# Altium schematic sheet IC2.SchDoc
size A4; SheetNumber: 2; SheetTotal: 4
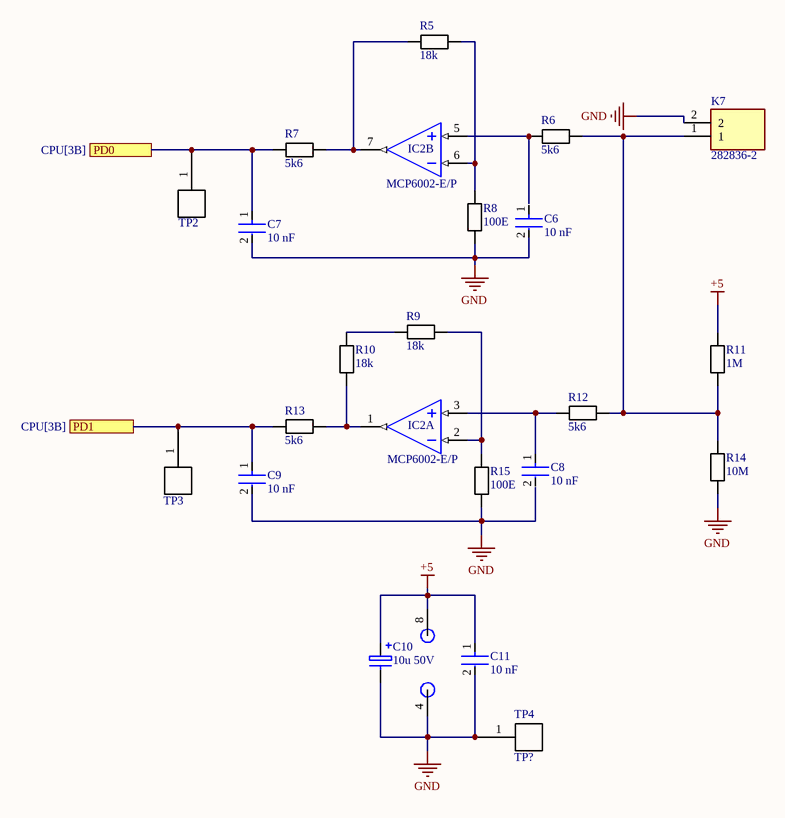
[diagram p0: IC2.SchDoc]

## Parts
C6  10 nF  [0805]
C7  10 nF  [0805]
C8  10 nF  [0805]
C9  10 nF  [0805]
C10  10u 50V  [Elco 10uF 50V]
C11  10 nF  [0805]
IC2  MCP6002-E/P  [MCP6002-E/P]  (parts A,B of 2)
K7  282836-2  [Schroefconnector 2 Pin]
R5  18k  [registor]
R6  5k6  [registor]
R7  5k6  [registor]
R8  100E  [registor]
R9  18k  [registor]
R10  18k  [registor]
R11  1M  [registor]
R12  5k6  [registor]
R13  5k6  [registor]
R14  10M  [registor]
R15  100E  [registor]
TP2  TP2  [testpunt]  (value not drawn)
TP3  TP?  [testpunt]  (value not drawn)
TP4  TP?  [testpunt]

## Ports
PD0 (see CPU[3B]), PD1 (see CPU[3B])

## Nets
+5: C10.1 C11.1 IC2.8 R11.1
GND: C6.2 C7.2 C9.2 C10.2 C11.2 IC2.4 K7.2 R8.1 R14.1 R15.1 TP4.1
PD0: C7.1 R7.1 TP2.1 ; port PD0
PD1: C9.1 R13.1 TP3.1 ; port PD1
NetC8_1: C8.1 IC2.3(VINA+) R12.1
NetIC2_1: IC2.1(VOUTA) R10.2 R13.2
NetIC2_2: IC2.2(VINA-) R9.1 R15.2
NetIC2_5: IC2.5(VINB+) R6.1
NetIC2_6: IC2.6(VINB-) R5.2 R8.2
NetIC2_7: IC2.7(VOUTB) R5.1 R7.2
NetK7_1: K7.1 R6.2 R11.2 R12.2 R14.2
NetR9_2: R9.2 R10.1

Not connected (* = marked no-connect by the designer): C6 1; C8 2

## Library data of the parts
C6-C9 C11 = Condensator 0805: Chip Multilayer Ceramic Capacitors for General Purpose, 0805, 10uF, X5R, 15%, 10%, 25V; Length: 2mm; Depth: 1.25mm; Termination: SMD/SMT; Voltage: 25V; Height: 1.25mm; Material: Ceramic; Thickness: 0.053inch; Radiation Hardening: No; Min Operating Temperature: -55°C; Width: 0.049inch; Package Quantity: 1; Mount: Surface Mount; Dielectric: X5R; Packaging: Tape and Reel; Capacitance: 10uF; Voltage Rating (DC): 25V; Lead Free: Lead Free; Max Operating Temperature: 85°C; Case Code (Imperial): 0805; Case/Package: 0805; Tolerance: 10%; Voltage Rating: 25V; Case Code (Metric): 2012
C10 = Condensator Elco: Part Number: 02015A270JAT2A; Manufacturer: AVX Interconnect / Elco
IC2 = MCP6002-E/P: None; Slew Rate: 0.6V/µs; Supply Current: 100uA; Power Supply Rejection Ratio (PSRR): 86dB; Input Offset Voltage (Vos): 4.5mV; Input Bias Current: 1pA; Amplifier Type: GENERAL PURPOSE; Unity Gain Bandwidth Product: 1MHz; Number of Circuits: 2; Output Current: 23mA; Operating Supply Voltage: 5.5V; Min Supply Voltage: 1.8V; Common Mode Rejection Ratio: 60dB; Voltage Gain: 112dB; Max Supply Voltage: 6V; Package Quantity: 60; REACH SVHC: No SVHC; Min Operating Temperature: -40°C; Max Operating Temperature: 125°C; Mount: Through Hole; Nominal Supply Current: 100uA; Height: 3.3mm; Length: 9.27mm; Slew Rate-Nom: 0.6V/µs; Packaging: Rail/Tube; Output Current per Channel: 23mA; Number of Amplifiers: 2; RoHS Compliant: Yes; Radiation Hardening: No; Bandwidth: 1MHz; Lead Free: Lead Free; Width: 6.35mm; Number of Channels: 2; Gain Bandwidth Product: 1MHz; Technology: CMOS; Operating Supply Current: 100uA; Number of Elements: 2; Number of Pins: 8; Input Offset Voltage-Max: 4.5mV; Case/Package: PDIP
K7 = Schroefconnector 2 Pin L: Connector; Manufacturer_Name: TE Connectivity; Datasheet Link: https://www.te.com/commerce/DocumentDelivery/DDEController?Action=showdoc&DocId=Customer+Drawing%7F282836%7FJ%7Fpdf%7FEnglish%7FENG_CD_282836_J.pdf%7F282836-2; Height: 10mm; Manufacturer_Part_Number: 282836-2
R5-R15 = resistor: Manufacturer: Vishay Dale; Part Number: CRCW08050000Z0EA
TP2-TP4 = testpunt